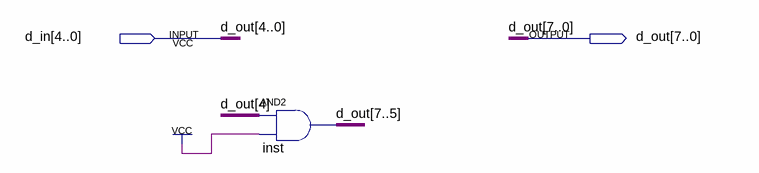
[diagram p0: schematic sheet]
// Quartus schematic sign_ext_5_8.bdf as structural Verilog: 1 symbols, 2 pins
module sign_ext_5_8 (
  input  [4:0] d_in,
  output [7:0] d_out
);

  assign d_out[7:5] = {3{d_in[4]}} & 3'b111;  // AND2 inst, 3 bits wide

  assign d_out[4:0] = d_in;
endmodule
